# EAGLE design oled_watch_ver2.3 (EAGLE 9.6.2)
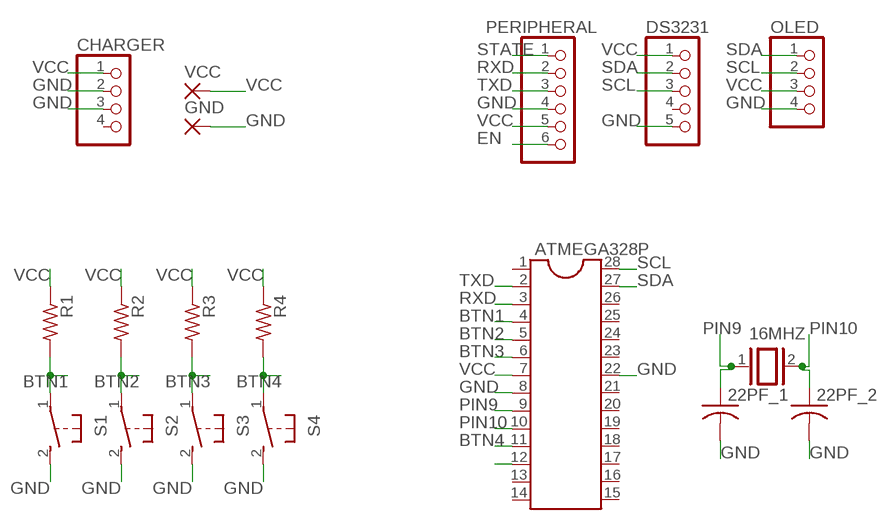
[diagram p0: schematic, sheet 1]

## Parts
16MHZ  XTAL/S  [QS]
22PF_1  C-US025-024X044  [C025-024X044]
22PF_2  C-US025-024X044  [C025-024X044]
ATMEGA328P  DIL28-3  [DIL28-3]
CHARGER  PINHD-1X4  [1X04]
DS3231  PINHD-1X5  [1X05]
GND  2,54/0,8  [2,54/0,8]
OLED  PINHD-1X4  [1X04]
PERIPHERAL  PINHD-1X6  [1X06]
R1  R-US_0207/7  [0207/7]
R2  R-US_0207/7  [0207/7]
R3  R-US_0207/7  [0207/7]
R4  R-US_0207/7  [0207/7]
S1  31-XX  [B3F-31XX]
S2  31-XX  [B3F-31XX]
S3  31-XX  [B3F-31XX]
S4  31-XX  [B3F-31XX]
VCC  2,54/0,8  [2,54/0,8]

## Nets
BTN1: ATMEGA328P.4 R1.2 S1.1(P)
BTN2: ATMEGA328P.5 R2.2 S2.1(P)
BTN3: ATMEGA328P.6 R3.2 S3.1(P)
BTN4: ATMEGA328P.11 R4.2 S4.1(P)
EN: PERIPHERAL.6
GND: 22PF_1.2 22PF_2.2 ATMEGA328P.8 ATMEGA328P.22 CHARGER.2 CHARGER.3 DS3231.5 GND.1(P) OLED.4 PERIPHERAL.4 S1.2(S) S2.2(S) S3.2(S) S4.2(S)
LED: ATMEGA328P.12
PIN9: 16MHZ.1 22PF_1.1 ATMEGA328P.9
PIN10: 16MHZ.2 22PF_2.1 ATMEGA328P.10
RXD: ATMEGA328P.3 PERIPHERAL.2
SCL: ATMEGA328P.28 DS3231.3 OLED.2
SDA: ATMEGA328P.27 DS3231.2 OLED.1
STATE: PERIPHERAL.1
TXD: ATMEGA328P.2 PERIPHERAL.3
VCC: ATMEGA328P.7 CHARGER.1 DS3231.1 OLED.3 PERIPHERAL.5 R1.1 R2.1 R3.1 R4.1 VCC.1(P)
Unconnected: ATMEGA328P.1 ATMEGA328P.13 ATMEGA328P.14 ATMEGA328P.15 ATMEGA328P.16 ATMEGA328P.17 ATMEGA328P.18 ATMEGA328P.19 ATMEGA328P.20 ATMEGA328P.21 ATMEGA328P.23 ATMEGA328P.24 ATMEGA328P.25 ATMEGA328P.26 CHARGER.4 DS3231.4

## Library data of the parts
16MHZ = special:XTAL/S: CRYSTAL
22PF_1 22PF_2 = rcl:C-US: CAPACITOR, American symbol; SPICEPREFIX: C
ATMEGA328P = ic-package:DIL28: Dual In Line
CHARGER OLED = pinhead:PINHD-1X4: PIN HEADER
DS3231 = pinhead:PINHD-1X5: PIN HEADER
GND VCC = wirepad:2,54/0,8: THROUGH-HOLE PAD
PERIPHERAL = pinhead:PINHD-1X6: PIN HEADER
R1-R4 = rcl:R-US_: RESISTOR, American symbol; SPICEPREFIX: R
S1-S4 = switch-omron:31-XX: OMRON SWITCH; MPN: B3F-3100; OC_FARNELL: 959704; OC_NEWARK: 36M3582

## Board
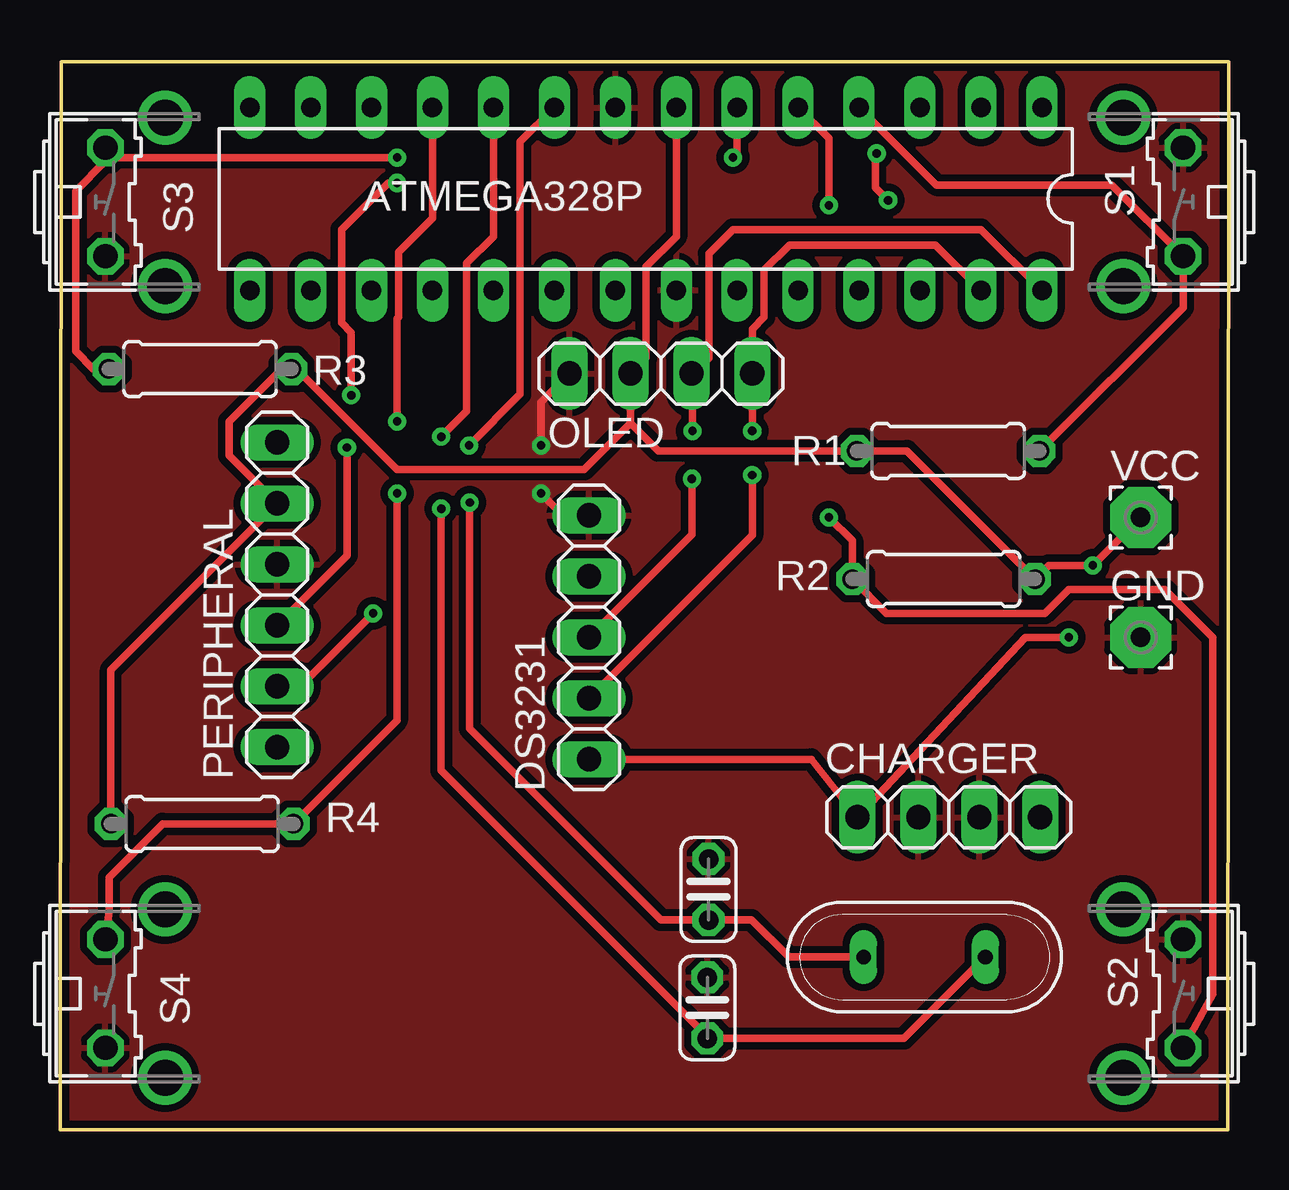
[diagram p1: board, top side]
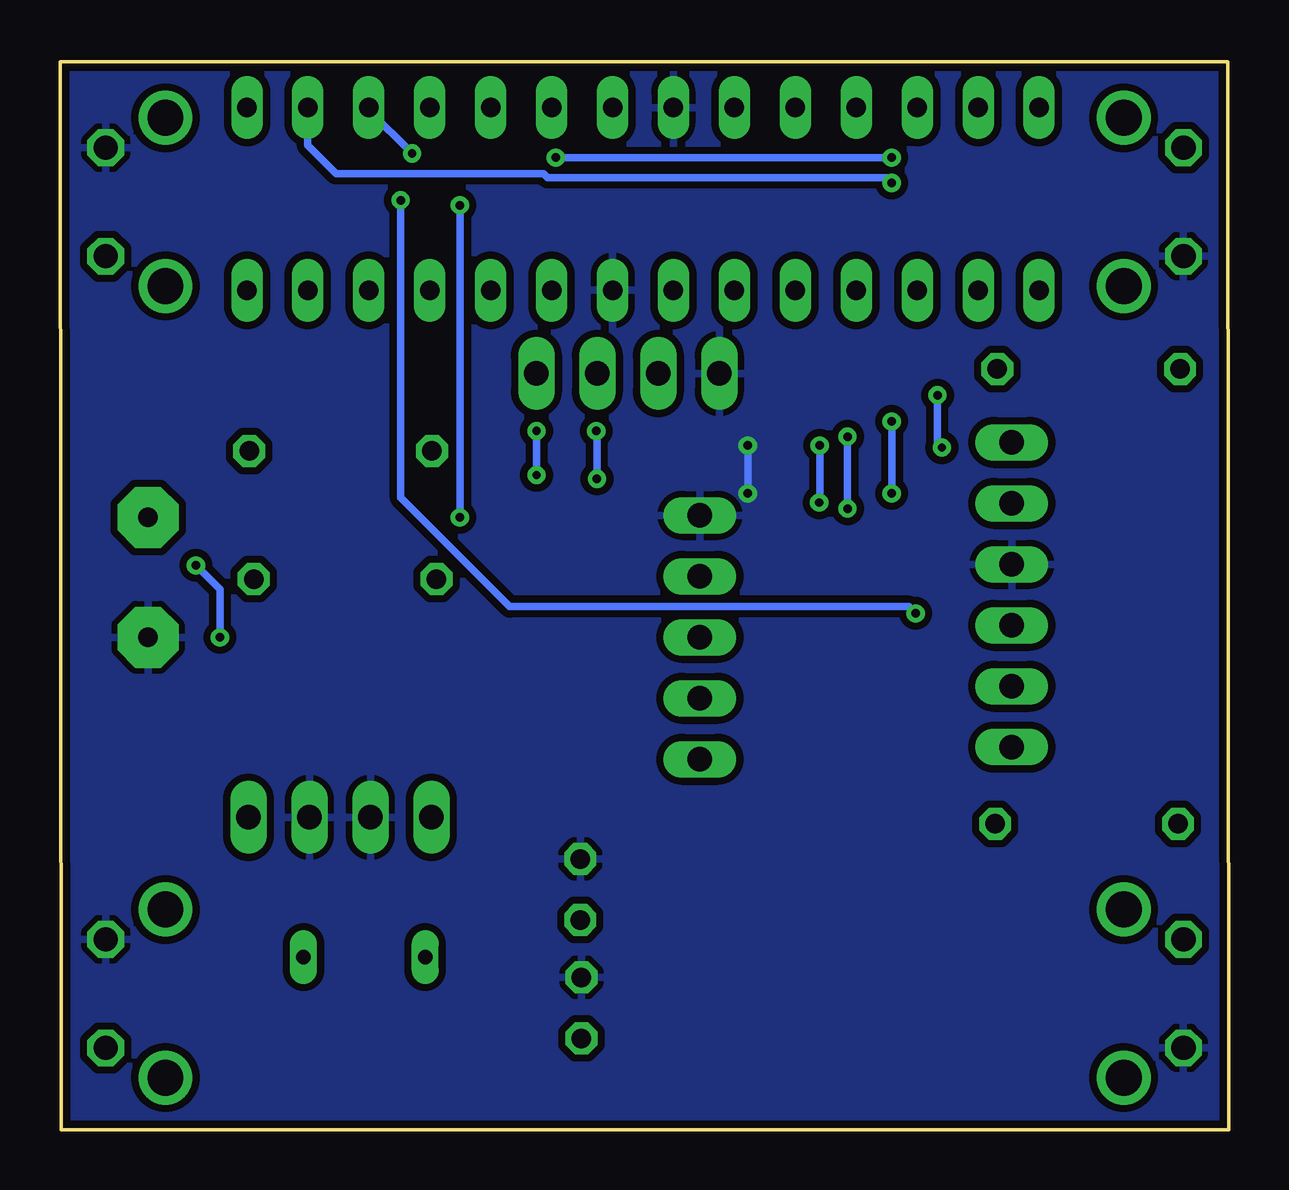
[diagram p2: board, bottom side, seen from below]

Size 48.72 x 44.52 mm. Coordinates in mm from the lower left corner, seen from the top.
Outline: 0,0 48.67,0 48.72,44.52 0.05,44.52 0,0
Copper layers (1*16): Top 0.035mm / dielectric 1.5mm / Bottom 0.035mm
Design rules "elcdrc": minimum track width 12mil, minimum drill 0.3mm, track to track 12mil, track to pad 12mil, pad to pad 12mil, via to via 12mil, smd to smd 6mil, copper to edge 12mil, drill to drill 12mil, minimum pad ring 10mil, minimum via ring 8mil, stop-mask expansion 4mil, vias tented up to drill 0mil, thermal gap 10mil

### Footprints (pad centres in the part's own frame; a part is rotated, then mirrored left to right if it is on the bottom)
QS = drill 0.61 long: 1 -2.54,0; 2 2.54,0
C025-024X044 = drill 0.813 octagon: 1 -1.27,0; 2 1.27,0
DIL28-3 = drill 0.813 long: 1 -16.51,-3.81; 2 -13.97,-3.81; 3 -11.43,-3.81; 4 -8.89,-3.81; 5 -6.35,-3.81; 6 -3.81,-3.81; 7 -1.27,-3.81; 8 1.27,-3.81; 9 3.81,-3.81; 10 6.35,-3.81; 11 8.89,-3.81; 12 11.43,-3.81; 13 13.97,-3.81; 14 16.51,-3.81; 15 16.51,3.81; 16 13.97,3.81; 17 11.43,3.81; 18 8.89,3.81; 19 6.35,3.81; 20 3.81,3.81; 21 1.27,3.81; 22 -1.27,3.81; 23 -3.81,3.81; 24 -6.35,3.81; 25 -8.89,3.81; 26 -11.43,3.81; 27 -13.97,3.81; 28 -16.51,3.81
1X04 = drill 1.016 long: 1 -3.81,0; 2 -1.27,0; 3 1.27,0; 4 3.81,0
1X05 = drill 1.016 long: 1 -5.08,0; 2 -2.54,0; 3 0,0; 4 2.54,0; 5 5.08,0
2,54/0,8 = drill 0.813 pad 2.54 octagon: 1 0,0
1X06 = drill 1.016 long: 1 -6.35,0; 2 -3.81,0; 3 -1.27,0; 4 1.27,0; 5 3.81,0; 6 6.35,0
0207/7 = drill 0.813 octagon: 1 -3.81,0; 2 3.81,0
B3F-31XX = drill 1.016 octagon: 1 -2.261,-1.245; 2 2.261,-1.245 | drill 1.499 pad 2.159: 3 -3.505,1.245; 4 3.505,1.245

### Placement (x,y rotation side)
16MHZ  36.03,7.19 0 top
22PF_1  27.03,10.01 90 top
22PF_2  26.98,5.07 90 top
ATMEGA328P  24.42,38.79 180 top
CHARGER  37.05,13.02 0 top
DS3231  22.05,20.52 90 top
GND  45.05,20.52 0 top
OLED  25.05,31.52 180 top
PERIPHERAL  9.05,22.29 90 top
R1  37.02,28.29 0 top
R2  36.83,22.95 180 top
R3  5.84,31.7 180 top
R4  5.93,12.74 0 top
S1  45.57,38.67 90 top
S2  45.57,5.67 90 top
S3  3.14,38.67 270 top
S4  3.14,5.67 270 top
VCC  45.05,25.52 0 top

### Tracks (layer width: path | path; a pad name or v marks a point on that pad's centre or on a via)
BTN1
  Top 0.305: R1.2 46.81,34.27 S1.1 43.85,39.37 36.54,39.37 ATMEGA328P.4
BTN2  (via drill 0.35)
  Top 0.305: S2.1 48.05,5.64 48.05,20.52 46.05,22.52 42.05,22.52 41.05,21.52 34.45,21.52 R2.2 33.02,24.54 v32.05,25.52 | ATMEGA328P.5 32.05,41.32 v32.05,38.53
  Bottom 0.305: v32.05,38.53 v32.05,25.52
BTN3  (via drill 0.35)
  Top 0.305: R3.2 1.39,31.7 0.65,32.44 0.65,39.12 1.89,40.36 S3.1 2.3,40.52 v14.05,40.52 | ATMEGA328P.6 28.23,40.7 v28.05,40.52
  Bottom 0.305: v28.05,40.52 v14.05,40.52
BTN4  (via drill 0.35)
  Top 0.305: S4.1 2.05,9.09 2.05,10.52 4.27,12.74 R4.2 14.05,17.05 v14.05,26.52 | ATMEGA328P.11 15.53,38 14.11,36.57 14.11,33.86 14.05,33.8 v14.05,29.52
  Bottom 0.305: v14.05,29.52 v14.05,26.52
GND  (via drill 0.35)
  Top 0.305: OLED.4 20.05,30.33 v20.05,28.52 | v20.05,26.52 20.97,25.6 DS3231.5
  Bottom 0.305: v20.05,28.52 v20.05,26.52
  pour Bottom: -4.49,47.86 -4.49,-1.02 51.31,-1.02 51.31,47.86
  pour Top: -2.95,47.52 -2.95,-0.48 51.05,-0.48 51.05,47.52
PIN9  (via drill 0.35)
  Top 0.305: 16MHZ.1 30.38,7.19 28.83,8.74 27.05,8.74 22PF_1.1 25.05,8.74 17.08,16.71 v17.08,26.14 | ATMEGA328P.9 19.19,41.18 19.19,30.65 v17.05,28.52
  Bottom 0.305: v17.05,28.52 17.05,26.16 v17.08,26.14
PIN10  (via drill 0.35)
  Top 0.305: 22PF_2.1 27.05,3.8 | 27.05,3.8 35.19,3.8 16MHZ.2 | ATMEGA328P.10 18.07,37.22 16.95,36.11 16.95,29.94 v15.89,28.88 | v15.89,25.88 15.89,14.96 27.05,3.8
  Bottom 0.305: v15.89,28.88 v15.89,25.88
RXD  (via drill 0.35)
  Top 0.305: PERIPHERAL.2 10.01,18.48 v13.05,21.52 | v34.52,38.74 33.98,39.27 33.98,40.63 v34.04,40.69
  Bottom 0.305: v13.05,21.52 13.33,21.79 29.97,21.79 34.52,26.34 v34.52,38.74 | v34.04,40.69 35.85,42.5 ATMEGA328P.3
SCL  (via drill 0.35)
  Top 0.305: DS3231.3 26.34,24.81 v26.34,27.13 | v26.36,29.12 26.36,31.47 | 26.36,31.47 OLED.2 | ATMEGA328P.28 38.39,37.52 28.05,37.52 27.05,36.52 27.05,32.16 26.36,31.47
  Bottom 0.305: v26.34,27.13 26.34,29.1 v26.36,29.12
SDA  (via drill 0.35)
  Top 0.305: ATMEGA328P.27 36.5,36.87 30.4,36.87 29.35,35.81 29.35,33.86 28.86,33.37 OLED.1 v28.86,29.13 v28.85,29.12 | v28.85,27.28 28.85,24.78 DS3231.2
  Bottom 0.305: v28.85,29.12 v28.85,27.28
TXD  (via drill 0.35)
  Top 0.305: PERIPHERAL.3 11.96,23.93 v11.96,28.43 | v12.14,30.61 12.14,33.22 11.73,33.63 11.73,37.52 13.67,39.46 v14.05,39.46
  Bottom 0.305: v11.96,28.43 12.14,28.61 v12.14,30.61 | v14.05,39.46 14.28,39.68 28.4,39.68 28.57,39.85 37.21,39.85 38.39,41.03 ATMEGA328P.2
VCC  (via drill 0.35)
  Top 0.305: v42.05,20.52 40.24,20.52 CHARGER.1 31.32,15.44 DS3231.1 | VCC.1 v43.05,23.52 41.21,23.52 R2.1 35.31,28.29 R1.1 24.94,28.29 23.78,29.45 | R4.1 2.12,19.17 PERIPHERAL.5 7.05,28.1 7.05,29.52 9.23,31.7 R3.1 9.87,31.7 14.05,27.52 21.85,27.52 23.78,29.45 | 23.78,29.45 OLED.3 24.43,32.17 24.43,35.97 25.69,37.22 ATMEGA328P.7
  Bottom 0.305: v42.05,20.52 42.05,22.52 v43.05,23.52